# Altium project PowerMonitorBoard.PrjPcb
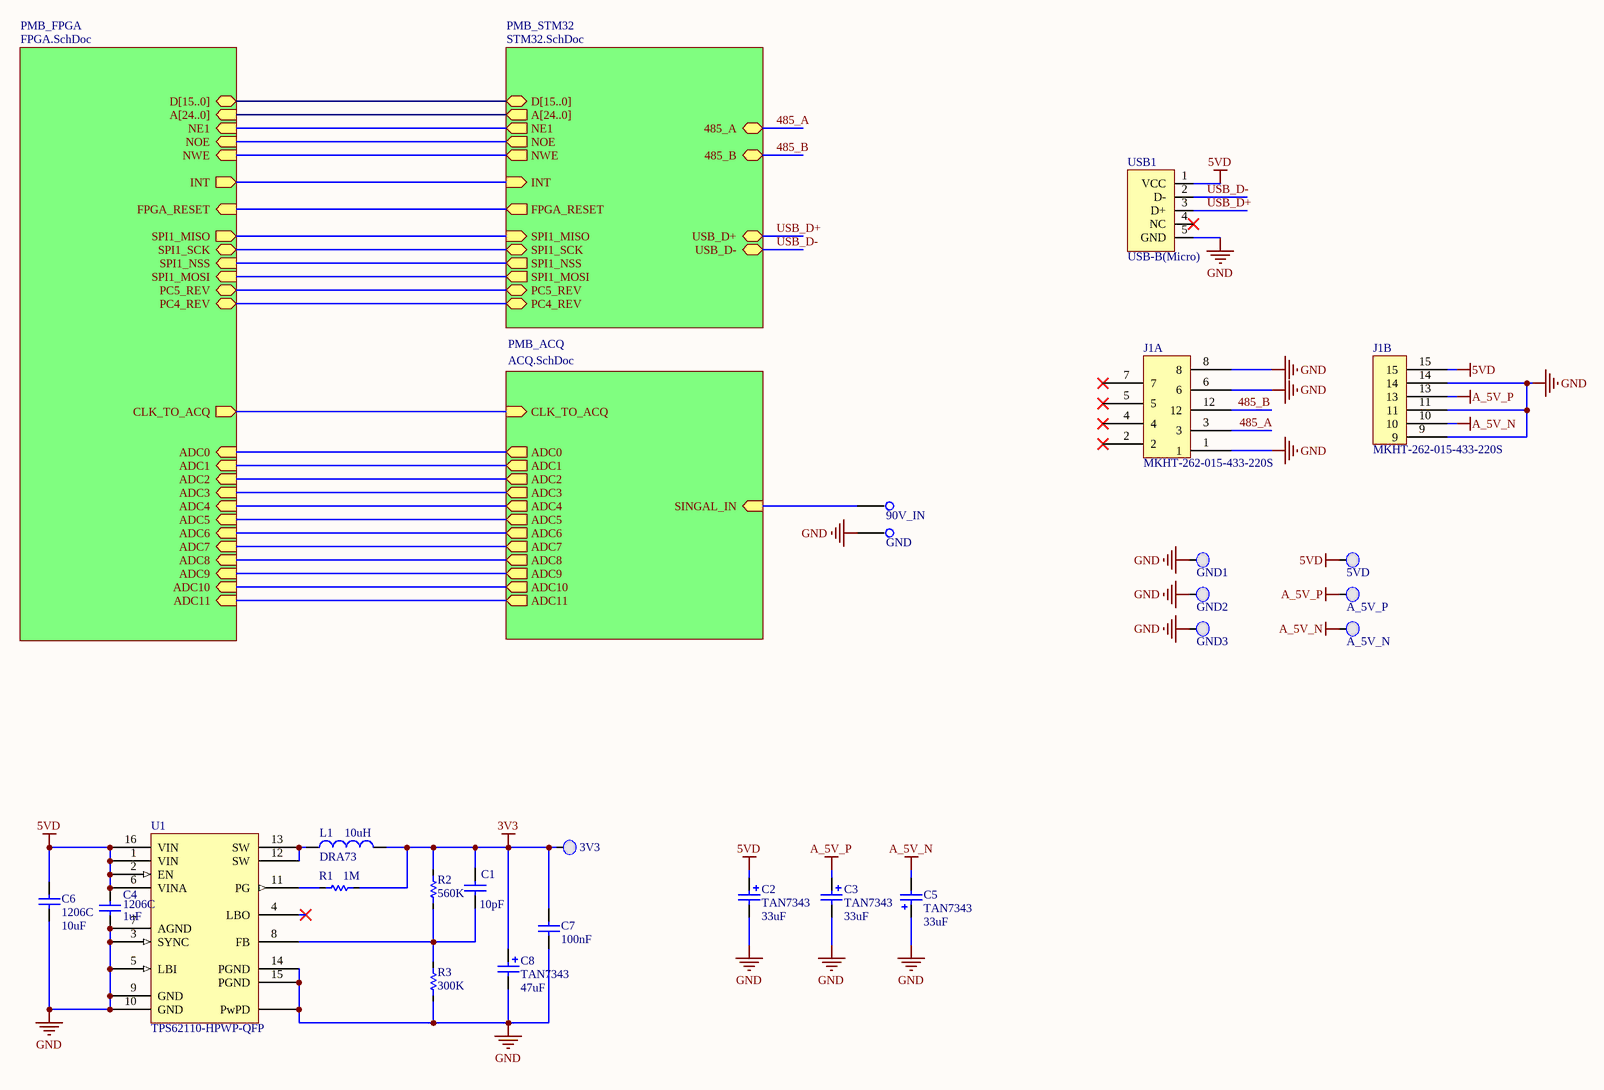
[diagram p0: TOP.SchDoc]
4 sheets, 182 parts. Net scope: hierarchical (ports join the sheet entries above them; power ports are global).
Board file: PMC_liuyao.PcbDoc
Sheets:
  TOP.SchDoc
    PMB_STM32 = STM32.SchDoc
    PMB_FPGA = FPGA.SchDoc
    PMB_ACQ = ACQ.SchDoc

## Sheet TOP.SchDoc
size A3; DocumentNumber: 1; SheetNumber: 1; SheetTotal: 4

### Parts
3V3  TP  [TPA]  (value not drawn)
5VD  TP  [TPA]  (value not drawn)
90V_IN  InOut  [TERMPOWER]  (value not drawn)
A_5V_N  TP  [TPA]  (value not drawn)
A_5V_P  TP  [TPA]  (value not drawn)
C1  10pF  [0805C]
C2  TAN7343  value 33uF  [7343C]
C3  TAN7343  value 33uF  [7343C]
C4  1uF  [1206C]
C5  TAN7343  value 33uF  [7343C]
C6  10uF  [1206C]
C7  100nF  [0805C]
C8  TAN7343  value 47uF  [7343C]
GND  InOut  [TERMPOWER]  (value not drawn)
GND1  TP  [TPA]  (value not drawn)
GND2  TP  [TPA]  (value not drawn)
GND3  TP  [TPA]  (value not drawn)
J1  MKHT-262-015-433-220S  [MKHT-262-015-433-220S]  (parts A,B of 2)
L1  DRA73  value 10uH  [INDP7676X35N]
R1  1M  [0805R]
R2  560K  [0805R]
R3  300K  [0805R]
U1  TPS62110-HPWP-QFP  [PWP16]
USB1  USB-B(Micro)  [MICRO-USB-SMD_5P-P0.65-H-F_C10418]

### Sub-sheets
PMB_ACQ = ACQ.SchDoc: ADC11 (out), ADC10 (out), ADC9 (out), ADC8 (out), ADC7 (out), ADC6 (out), ADC5 (out), ADC1 (out), ADC4 (out), ADC0 (out), ADC3 (out), CLK_TO_ACQ (in), ADC2 (out), SINGAL_IN (in)
PMB_FPGA = FPGA.SchDoc: D[15..0] (bidir), A[24..0] (in), FPGA_RESET (in), NE1 (in), NOE (in), NWE (in), ADC11 (in), ADC10 (in), ADC9 (in), ADC8 (in), ADC7 (in), ADC6 (in), ADC5 (in), ADC1 (in), ADC4 (in), ADC0 (in), ADC3 (in), ADC2 (in), CLK_TO_ACQ (out), INT (out), SPI1_MISO (out), SPI1_SCK (bidir), SPI1_NSS (in), SPI1_MOSI (in), PC5_REV (bidir), PC4_REV (bidir)
PMB_STM32 = STM32.SchDoc: D[15..0] (bidir), A[24..0] (out), 485_B (bidir), 485_A (bidir), NE1 (out), NOE (out), NWE (out), INT (in), FPGA_RESET (out), SPI1_MISO (in), SPI1_SCK (bidir), SPI1_NSS (out), SPI1_MOSI (out), PC5_REV (bidir), PC4_REV (bidir), USB_D+ (bidir), USB_D- (bidir)

### Nets
3V3: 3V3.1(TP) C1.2 C7.2 C8.1 L1.2 R1.2 R2.2
5VD: 5VD.1(TP) C2.1 C4.1 C6.1 J1.15 U1.1(VIN) U1.2(EN) U1.6(VINA) U1.16(VIN) USB1.1(VCC)
A_5V_N: A_5V_N.1(TP) C5.2 J1.10
A_5V_P: A_5V_P.1(TP) C3.1 J1.13
GND: C2.2 C3.2 C4.2 C5.1 C6.2 C7.1 C8.2 GND.1(NC) GND1.1(TP) GND2.1(TP) GND3.1(TP) J1.1 J1.6 J1.8 J1.9 J1.11 J1.14 R3.1 U1.3(SYNC) U1.5(LBI) U1.7(AGND) U1.9(GND) U1.10(GND) U1.14(PGND) U1.15(PGND) U1.PwPD USB1.5(GND)
485_A: J1.3 ; sheet PMB_STM32/485_A
485_B: J1.12 ; sheet PMB_STM32/485_B
NE1: sheet PMB_STM32/NE1, sheet PMB_FPGA/NE1
NOE: sheet PMB_STM32/NOE, sheet PMB_FPGA/NOE
NRST: sheet PMB_STM32/FPGA_RESET, sheet PMB_FPGA/FPGA_RESET
NWE: sheet PMB_STM32/NWE, sheet PMB_FPGA/NWE
PC4_REV: sheet PMB_STM32/PC4_REV, sheet PMB_FPGA/PC4_REV
PC5_REV: sheet PMB_STM32/PC5_REV, sheet PMB_FPGA/PC5_REV
SPI1_MISO: sheet PMB_STM32/SPI1_MISO, sheet PMB_FPGA/SPI1_MISO
SPI1_MOSI: sheet PMB_STM32/SPI1_MOSI, sheet PMB_FPGA/SPI1_MOSI
SPI1_NSS: sheet PMB_STM32/SPI1_NSS, sheet PMB_FPGA/SPI1_NSS
SPI1_SCK: sheet PMB_STM32/SPI1_SCK, sheet PMB_FPGA/SPI1_SCK
USB_D+: USB1.3(D+) ; sheet PMB_STM32/USB_D+
USB_D-: USB1.2(D-) ; sheet PMB_STM32/USB_D-
Net90V_IN_1: 90V_IN.1(NC) ; sheet PMB_ACQ/SINGAL_IN
NetADC11_1: sheet PMB_FPGA/ADC11, sheet PMB_ACQ/ADC11
NetADC_CLK_1: sheet PMB_FPGA/CLK_TO_ACQ, sheet PMB_ACQ/CLK_TO_ACQ
NetC1_1: C1.1 R2.1 R3.2 U1.8(FB)
NetIC1_73: sheet PMB_STM32/INT, sheet PMB_FPGA/INT
NetL1_1: L1.1 U1.12(SW) U1.13(SW)
NetR1_1: R1.1 U1.11(PG)
NetR16_1: sheet PMB_FPGA/ADC0, sheet PMB_ACQ/ADC0
NetR17_1: sheet PMB_FPGA/ADC1, sheet PMB_ACQ/ADC1
NetR19_1: sheet PMB_FPGA/ADC2, sheet PMB_ACQ/ADC2
NetR22_1: sheet PMB_FPGA/ADC3, sheet PMB_ACQ/ADC3
NetR23_1: sheet PMB_FPGA/ADC4, sheet PMB_ACQ/ADC4
NetR24_1: sheet PMB_FPGA/ADC5, sheet PMB_ACQ/ADC5
NetR25_1: sheet PMB_FPGA/ADC6, sheet PMB_ACQ/ADC6
NetR26_1: sheet PMB_FPGA/ADC7, sheet PMB_ACQ/ADC7
NetR27_1: sheet PMB_FPGA/ADC8, sheet PMB_ACQ/ADC8
NetR28_1: sheet PMB_FPGA/ADC9, sheet PMB_ACQ/ADC9
NetR29_1: sheet PMB_FPGA/ADC10, sheet PMB_ACQ/ADC10

Not connected (* = marked no-connect by the designer): J1 2* 4* 5* 7*; U1 4(LBO)*; USB1 4(NC)*

### Buses and harness runs
bus sheet PMB_FPGA/A[24..0] = sheet PMB_STM32/A[24..0]
bus sheet PMB_FPGA/D[15..0] = sheet PMB_STM32/D[15..0]

### Library data of the parts
C1 C4 C6 C7 = Cap: Capacitor; Published: 8-Jun-2000; LatestRevisionDate: 17-Jul-2002; LatestRevisionNote: Re-released for DXP Platform.; Publisher: Altium Limited; PackageDescription: Radial Cap, Thru-Hole; 2 Leads; 0.3 in Pin Spacing
  C1: PackageReference: RAD-0.3; Value: 10pF
  C4: PackageReference: 1206C; Value: 1uF
  C6: PackageReference: 1206C; Value: 10uF
  C7: PackageReference: RAD-0.3; Value: 100nF
C2 C3 C5 C8 = Cap Pol: Polarized Capacitor (Radial)
L1 = Inductor
R1-R3 = Res1: Resistor; Published: 8-Jun-2000; LatestRevisionDate: 17-Jul-2002; LatestRevisionNote: Re-released for DXP Platform.; PackageReference: AXIAL-0.3; Publisher: Altium Limited; PackageDescription: Axial Device, Thru-Hole; 2 Leads; 0.3 in Pin Spacing
  R1: Value: 1M
  R2: Value: 560K
  R3: Value: 300K
U1 = TPS62110-HPWP: Part Number: Y20033002; 安装形式: SMT; 产品外形尺寸<高>: 1.2mm; 产品外形尺寸<长>: 6.6mm; 产品外形尺寸<宽>: 5.1mm; 引脚数目: 16; 湿敏等级（回流焊峰值）: MSL2(260C); 描述: TI;TPS62110-HPWP;175℃;HTSSOP 16PINS;MSL2(260C); id: wt.part.WTPartMaster:8901760; folder: /Default/电源及电源管理/TPS62110HPWP; 主要参数: 17-V, 1.5-A, SYNCHRONOUS STEP-DOWN CONVERTER; state: APPROVED; parent: 13; Library Path 2: 0; Library Ref: TPS62110-HPWP; Footprint Path: 0; HelpURL: \\10.185.226.160\altium_center_db\DATASHEET\TI TPS62110-HT.pdf; Footprint Ref: 0; Library Path: TPS62110-HT.SchLib; 制造商型号: TPS62110-HPWP; pname: TPS62110-HPWP; Library Ref 2: 0; Footprint Path 2: 0; Footprint Ref 2: 0; Footprint Path 3: 0; Footprint Ref 3: 0
USB1 = USB-micro

## Sheet STM32.SchDoc
size A3; DocumentNumber: 3; SheetNumber: 3; SheetTotal: 4
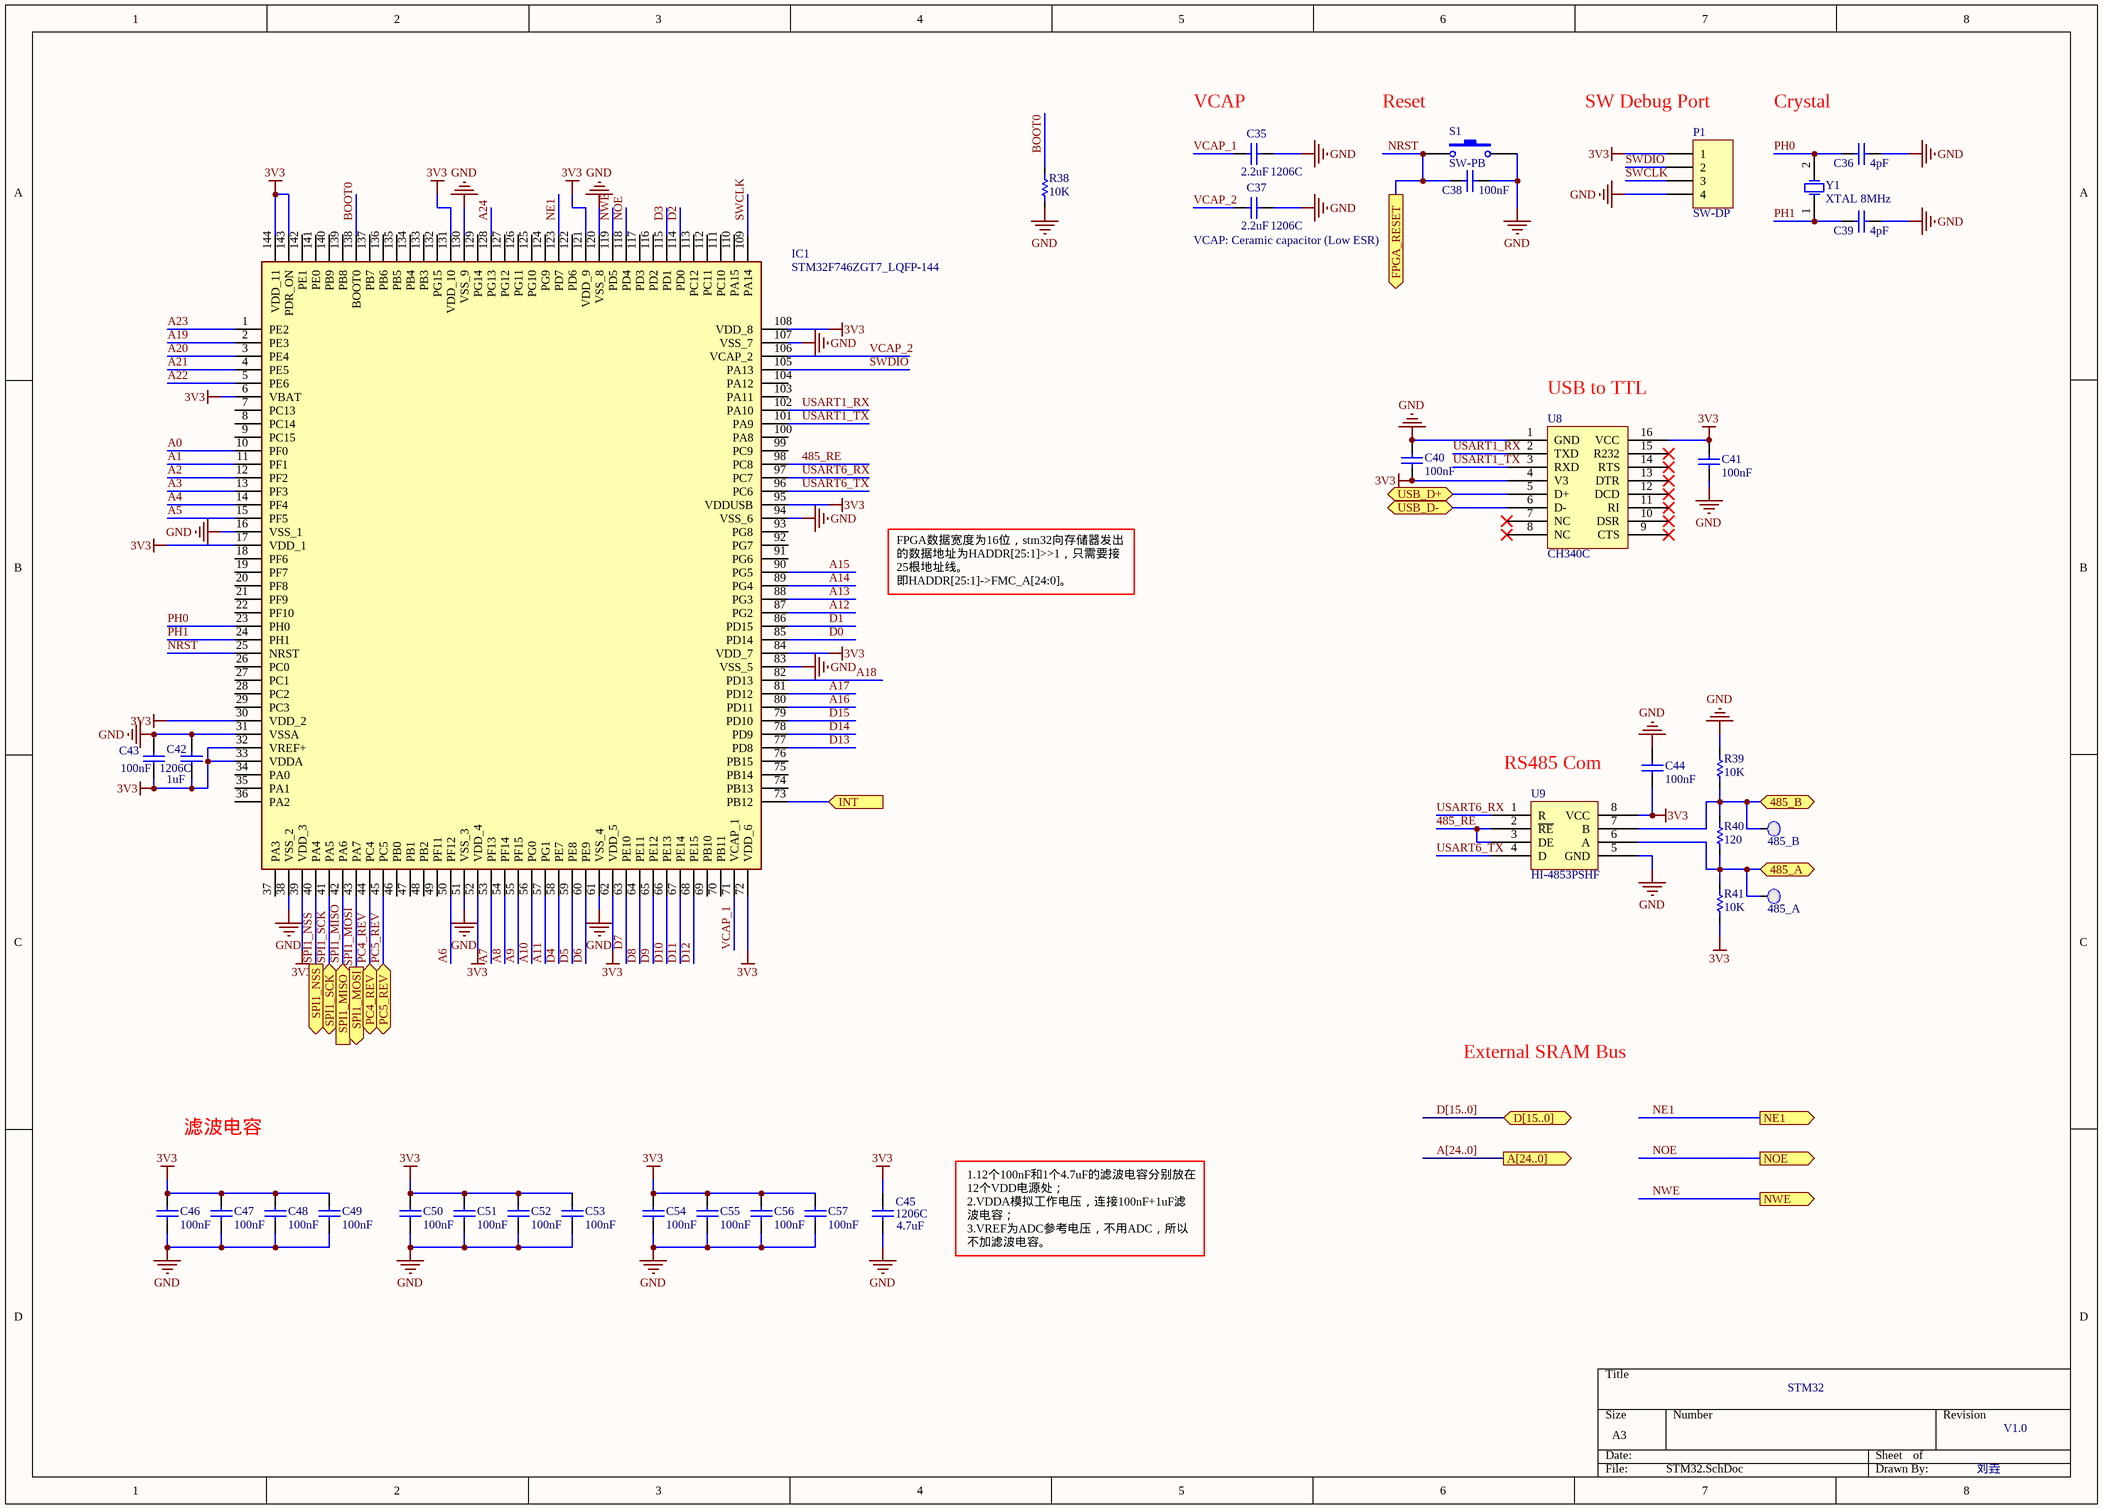
[diagram p1: STM32.SchDoc]

### Parts
485_A  TP  [TPA]  (value not drawn)
485_B  TP  [TPA]  (value not drawn)
C35  2.2uF  [1206C]
C36  4pF  [0805C]
C37  2.2uF  [1206C]
C38  100nF  [0805C]
C39  4pF  [0805C]
C40  100nF  [0805C]
C41  100nF  [0805C]
C42  1uF  [1206C]
C43  100nF  [0805C]
C44  100nF  [0805C]
C45  4.7uF  [1206C]
C46  100nF  [0805C]
C47  100nF  [0805C]
C48  100nF  [0805C]
C49  100nF  [0805C]
C50  100nF  [0805C]
C51  100nF  [0805C]
C52  100nF  [0805C]
C53  100nF  [0805C]
C54  100nF  [0805C]
C55  100nF  [0805C]
C56  100nF  [0805C]
C57  100nF  [0805C]
IC1  STM32F746ZGT7_LQFP-144  [QFP50P2200X2200X160-144N]
P1  SW-DP  [MHDR1X4]
R38  10K  [0805R]
R39  10K  [0805R]
R40  120  [0805R]
R41  10K  [0805R]
S1  SW-PB  [SW-SMD_L6.0-W3.5-LS8.0]
U8  CH340C  [CH340C]
U9  HI-4853PSHF  [SOIC-8N]
Y1  XTAL 8MHz  [NX3225GD8MHZSTDCRA3]

### Ports
485_A (bidir), 485_B (bidir), A[24..0] (out), D[15..0] (bidir), FPGA_RESET (out), INT (in), NE1 (out), NOE (out), NWE (out), PC4_REV (bidir), PC5_REV (bidir), SPI1_MISO (in), SPI1_MOSI (out), SPI1_NSS (out), SPI1_SCK (bidir), USB_D+ (bidir), USB_D- (bidir)

### Nets
3V3: C40.1 C41.2 C42.1 C43.1 C44.1 C45.2 C46.2 C47.2 C48.2 C49.2 C50.2 C51.2 C52.2 C53.2 C54.2 C55.2 C56.2 C57.2 IC1.6(VBAT) IC1.17(VDD_1) IC1.30(VDD_2) IC1.32(VREF+) IC1.33(VDDA) IC1.39(VDD_3) IC1.52(VDD_4) IC1.62(VDD_5) IC1.72(VDD_6) IC1.84(VDD_7) IC1.95(VDDUSB) IC1.108(VDD_8) IC1.121(VDD_9) IC1.131(VDD_10) IC1.143(PDR_ON) IC1.144(VDD_11) P1.1 R41.1 U8.4(V3) U8.16(VCC) U9.8(VCC)
GND: C35.1 C36.2 C37.1 C38.2 C39.2 C40.2 C41.1 C42.2 C43.2 C44.2 C45.1 C46.1 C47.1 C48.1 C49.1 C50.1 C51.1 C52.1 C53.1 C54.1 C55.1 C56.1 C57.1 IC1.16(VSS_1) IC1.31(VSSA) IC1.38(VSS_2) IC1.51(VSS_3) IC1.61(VSS_4) IC1.83(VSS_5) IC1.94(VSS_6) IC1.107(VSS_7) IC1.120(VSS_8) IC1.130(VSS_9) P1.4 R38.2 R39.2 S1.2 U8.1(GND) U9.5(GND)
485_A: 485_A.1(TP) R40.1 R41.2 U9.6(A) ; port 485_A
485_B: 485_B.1(TP) R39.1 R40.2 U9.7(B) ; port 485_B
485_RE: IC1.98(PC8) U9.2(~{RE}) U9.3(DE)
A0: IC1.10(PF0)
A1: IC1.11(PF1)
A2: IC1.12(PF2)
A3: IC1.13(PF3)
A4: IC1.14(PF4)
A5: IC1.15(PF5)
A6: IC1.50(PF12)
A7: IC1.53(PF13)
A8: IC1.54(PF14)
A9: IC1.55(PF15)
A10: IC1.56(PG0)
A11: IC1.57(PG1)
A12: IC1.87(PG2)
A13: IC1.88(PG3)
A14: IC1.89(PG4)
A15: IC1.90(PG5)
A16: IC1.80(PD11)
A17: IC1.81(PD12)
A18: IC1.82(PD13)
A19: IC1.2(PE3)
A20: IC1.3(PE4)
A21: IC1.4(PE5)
A22: IC1.5(PE6)
A23: IC1.1(PE2)
A24: IC1.128(PG13)
BOOT0: IC1.138(BOOT0) R38.1
D0: IC1.85(PD14)
D1: IC1.86(PD15)
D2: IC1.114(PD0)
D3: IC1.115(PD1)
D4: IC1.58(PE7)
D5: IC1.59(PE8)
D6: IC1.60(PE9)
D7: IC1.63(PE10)
D8: IC1.64(PE11)
D9: IC1.65(PE12)
D10: IC1.66(PE13)
D11: IC1.67(PE14)
D12: IC1.68(PE15)
D13: IC1.77(PD8)
D14: IC1.78(PD9)
D15: IC1.79(PD10)
NE1: IC1.123(PD7) ; port NE1
NOE: IC1.118(PD4) ; port NOE
NRST: C38.1 IC1.25(NRST) S1.1 ; port FPGA_RESET
NWE: IC1.119(PD5) ; port NWE
PC4_REV: IC1.44(PC4) ; port PC4_REV
PC5_REV: IC1.45(PC5) ; port PC5_REV
PH0: C36.1 IC1.23(PH0) Y1.2(OSC2)
PH1: C39.1 IC1.24(PH1) Y1.1(OSC1)
SPI1_MISO: IC1.42(PA6) ; port SPI1_MISO
SPI1_MOSI: IC1.43(PA7) ; port SPI1_MOSI
SPI1_NSS: IC1.40(PA4) ; port SPI1_NSS
SPI1_SCK: IC1.41(PA5) ; port SPI1_SCK
SWCLK: IC1.109(PA14) P1.3
SWDIO: IC1.105(PA13) P1.2
USART1_RX: IC1.102(PA10) U8.2(TXD)
USART1_TX: IC1.101(PA9) U8.3(RXD)
USART6_RX: IC1.97(PC7) U9.1(R)
USART6_TX: IC1.96(PC6) U9.4(D)
USB_D+: U8.5(D+) ; port USB_D+
USB_D-: U8.6(D-) ; port USB_D-
VCAP_1: C35.2 IC1.71(VCAP_1)
VCAP_2: C37.2 IC1.106(VCAP_2)
NetIC1_73: IC1.73(PB12) ; port INT

Not connected (* = marked no-connect by the designer): IC1 7(PC13) 8(PC14) 9(PC15) 18(PF6) 19(PF7) 20(PF8) 21(PF9) 22(PF10) 26(PC0) 27(PC1) 28(PC2) 29(PC3) 34(PA0) 35(PA1) 36(PA2) 37(PA3) 46(PB0) 47(PB1) 48(PB2) 49(PF11) 69(PB10) 70(PB11) 74(PB13) 75(PB14) 76(PB15) 91(PG6) 92(PG7) 93(PG8) 99(PC9) 100(PA8) 103(PA11) 104(PA12) 110(PA15) 111(PC10) 112(PC11) 113(PC12) 116(PD2) 117(PD3) 122(PD6) 124(PG9) 125(PG10) 126(PG11) 127(PG12) 129(PG14) 132(PG15) 133(PB3) 134(PB4) 135(PB5) 136(PB6) 137(PB7) 139(PB8) 140(PB9) 141(PE0) 142(PE1); U8 7(NC)* 8(NC)* 9(CTS)* 10(DSR)* 11(RI)* 12(DCD)* 13(DTR)* 14(RTS)* 15(R232)*

### Buses and harness runs
bus A[24..0] = port A[24..0]
bus D[15..0] = port D[15..0]

### Notes on the sheet
- (near C35) VCAP
- (near S1) Reset
- (near P1) SW Debug Port
- Crystal
- (near C37) VCAP: Ceramic capacitor (Low ESR)
- (near U8) USB to TTL
- FPGA数据宽度为16位，stm32向存储器发出的数据地址为HADDR[25:1]>>1，只需要接25根地址线。
  即HADDR[25:1]->FMC_A[24:0]。
- RS485 Com
- External SRAM Bus
- 滤波电容
- 1.12个100nF和1个4.7uF的滤波电容分别放在12个VDD电源处；
  2.VDDA模拟工作电压，连接100nF+1uF滤波电容；
  3.VREF为ADC参考电压，不用ADC，所以不加滤波电容。
- STM32
- V1.0
- 刘垚

### Library data of the parts
C35-C57 = Cap: Capacitor; Published: 8-Jun-2000; LatestRevisionDate: 17-Jul-2002; LatestRevisionNote: Re-released for DXP Platform.; Publisher: Altium Limited; PackageDescription: Radial Cap, Thru-Hole; 2 Leads; 0.3 in Pin Spacing
  C35 C37: PackageReference: 1206C; Value: 2.2uF
  C36 C39: PackageReference: RAD-0.3; Value: 4pF
  C38 C40 C41 C43 C44 C46-C57: PackageReference: RAD-0.3; Value: 100nF
  C42: PackageReference: 1206C; Value: 1uF
  C45: PackageReference: 1206C; Value: 4.7uF
IC1 = STM32F746ZGT7: Integrated Circuit; Manufacturer_Name: STMicroelectronics; Datasheet Link: http://www.st.com/content/ccc/resource/technical/document/datasheet/96/ed/61/9b/e0/6c/45/0b/DM00166116.pdf/files/DM00166116.pdf/jcr:content/translations/en.DM00166116.pdf; Height: 1.6mm; Manufacturer_Part_Number: STM32F746ZGT7; Mouser Part Number: 511-STM32F746ZGT7; Mouser Price/Stock: https://www.mouser.co.uk/ProductDetail/STMicroelectronics/STM32F746ZGT7?qs=BA62vJVifGozpDSWhcdUmw%3D%3D
P1 = MHDR1X4: Header, 4-Pin; LatestRevisionDate: 17-Jul-2002; LatestRevisionNote: Re-released for DXP Platform.; Publisher: Altium Limited
R38-R41 = Res1: Resistor; Published: 8-Jun-2000; LatestRevisionDate: 17-Jul-2002; LatestRevisionNote: Re-released for DXP Platform.; PackageReference: AXIAL-0.3; Publisher: Altium Limited; PackageDescription: Axial Device, Thru-Hole; 2 Leads; 0.3 in Pin Spacing
  R38 R39 R41: Value: 10K
  R40: Value: 120
S1 = SW-PB: Switch; Published: 24-Mar-1999; LatestRevisionDate: 17-Jul-2002; LatestRevisionNote: Re-released for DXP Platform.; PackageReference: SPST-2; Publisher: Altium Limited; PackageDescription: Switch; 2 Leads
Y1 = XTAL: Crystal Oscillator; Published: 8-Jun-2000; LatestRevisionDate: 17-Jul-2002; LatestRevisionNote: Re-released for DXP Platform.; PackageReference: R38; Publisher: Altium Limited

## Sheet FPGA.SchDoc
size A3; DocumentNumber: 4; SheetNumber: 4; SheetTotal: 4
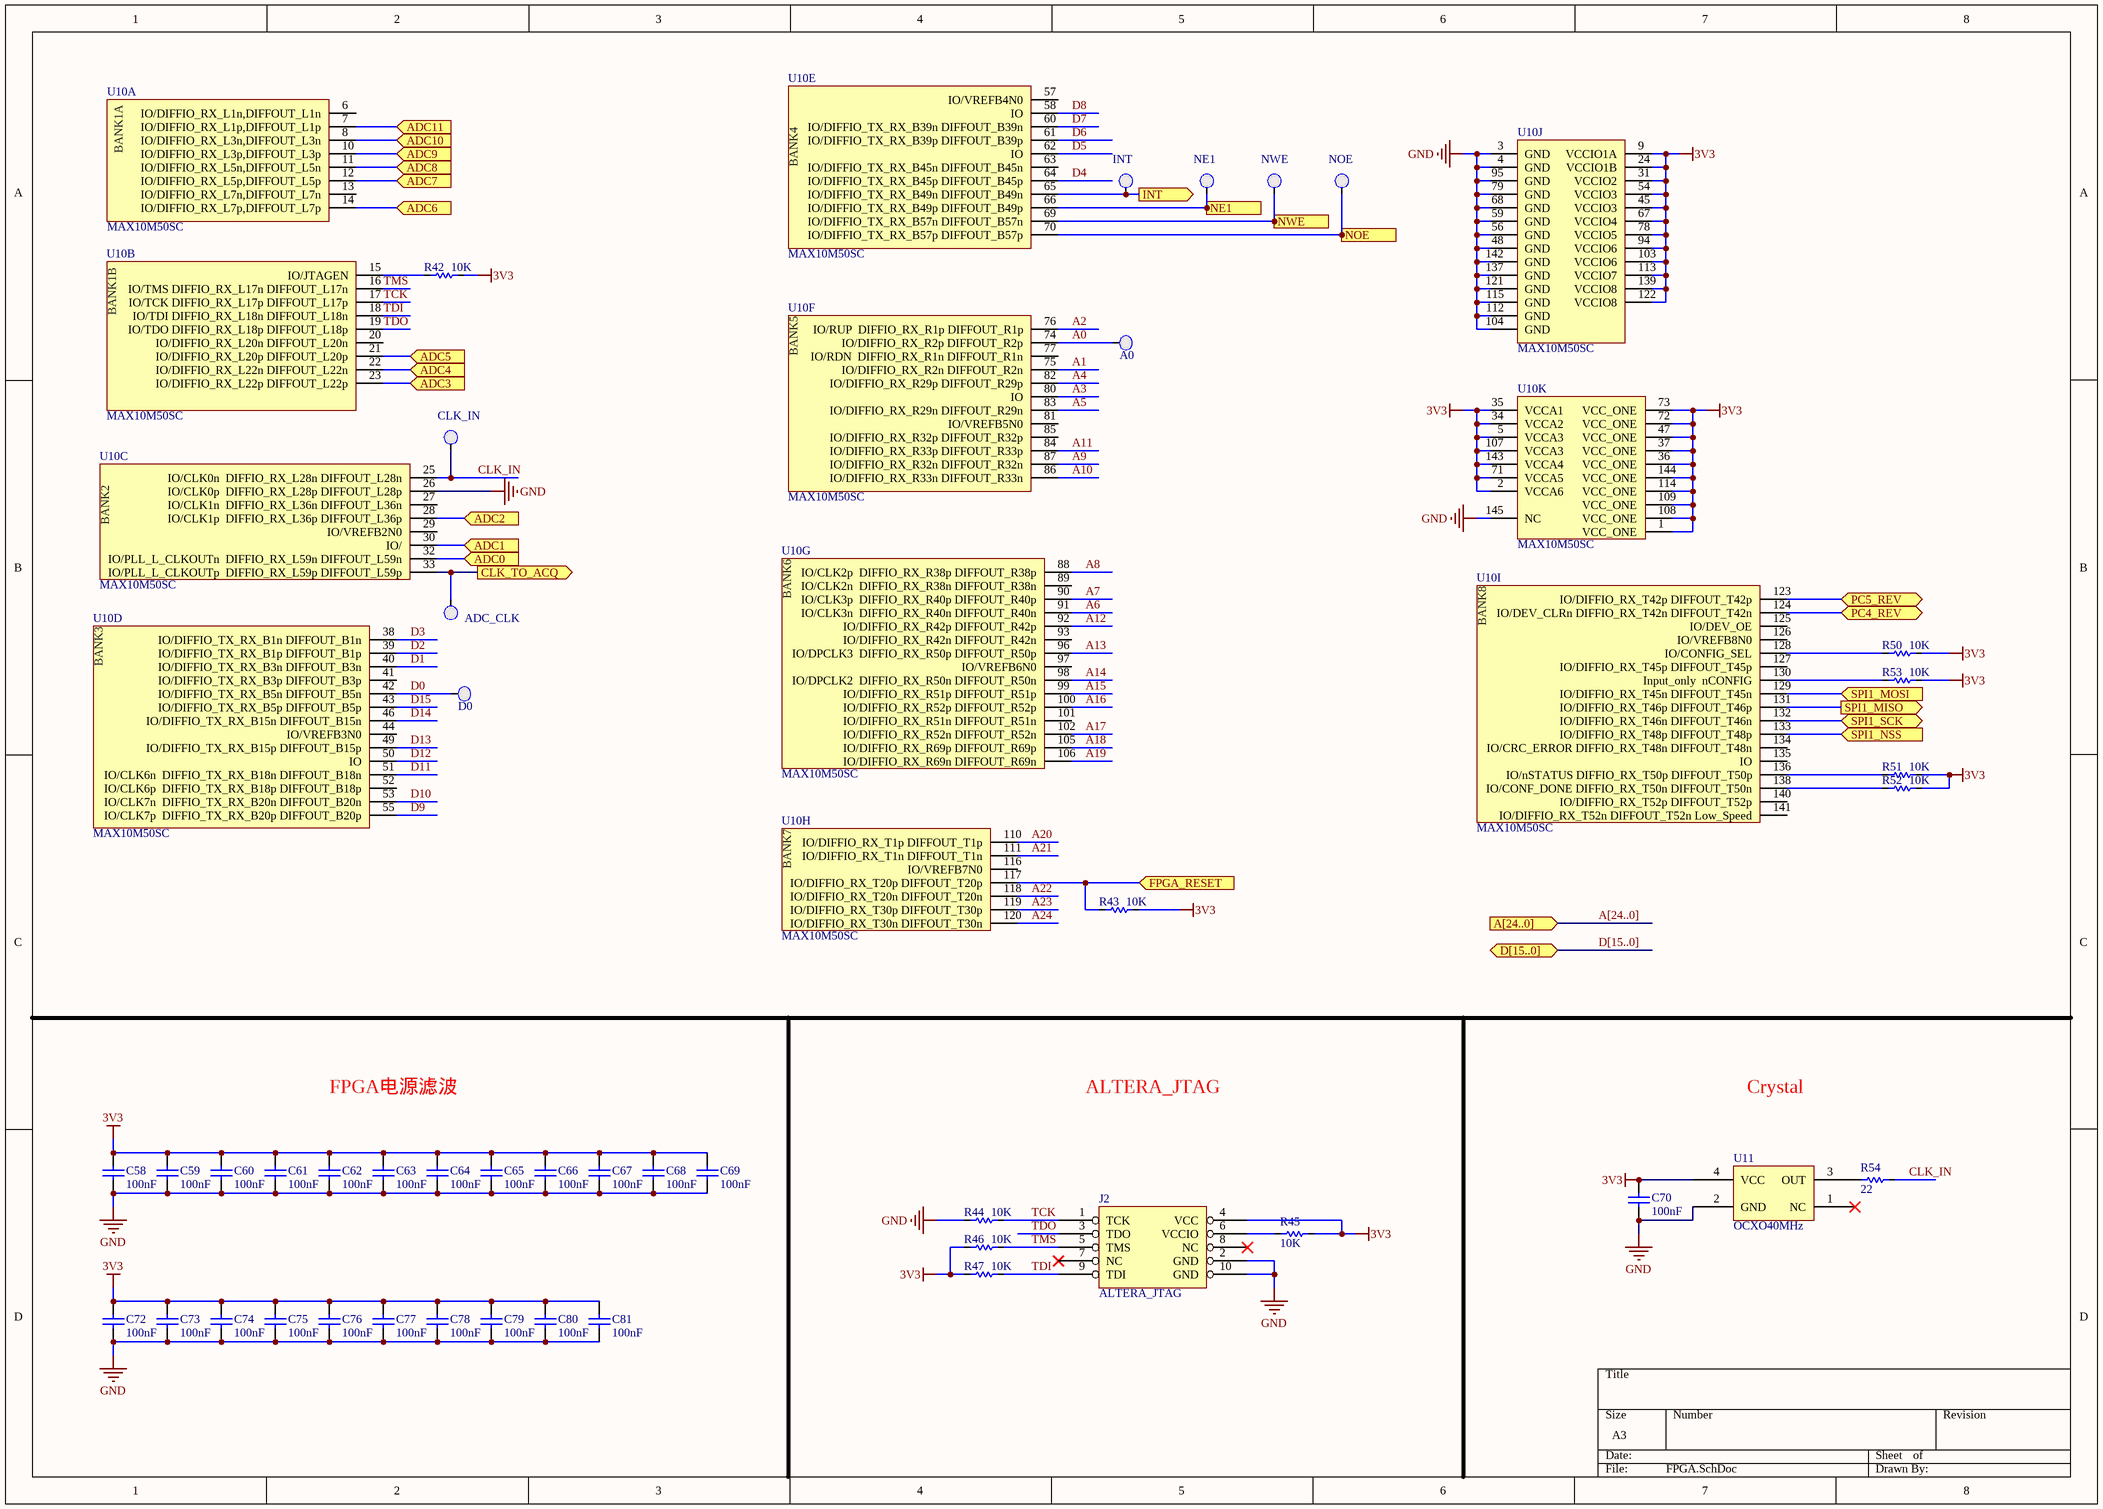
[diagram p2: FPGA.SchDoc]

### Parts
A0  TP  [TPA]  (value not drawn)
ADC_CLK  TP  [TPA]  (value not drawn)
C58  100nF  [0805C]
C59  100nF  [0805C]
C60  100nF  [0805C]
C61  100nF  [0805C]
C62  100nF  [0805C]
C63  100nF  [0805C]
C64  100nF  [0805C]
C65  100nF  [0805C]
C66  100nF  [0805C]
C67  100nF  [0805C]
C68  100nF  [0805C]
C69  100nF  [0805C]
C70  100nF  [0805C]
C72  100nF  [0805C]
C73  100nF  [0805C]
C74  100nF  [0805C]
C75  100nF  [0805C]
C76  100nF  [0805C]
C77  100nF  [0805C]
C78  100nF  [0805C]
C79  100nF  [0805C]
C80  100nF  [0805C]
C81  100nF  [0805C]
CLK_IN  TP  [TPA]  (value not drawn)
D0  TP  [TPA]  (value not drawn)
INT  TP  [TPA]  (value not drawn)
J2  ALTERA_JTAG  [JTAG_DIP]
NE1  TP  [TPA]  (value not drawn)
NOE  TP  [TPA]  (value not drawn)
NWE  TP  [TPA]  (value not drawn)
R42  10K  [0805R]
R43  10K  [0805R]
R44  10K  [0805R]
R45  10K  [0805R]
R46  10K  [0805R]
R47  10K  [0805R]
R50  10K  [0805R]
R51  10K  [0805R]
R52  10K  [0805R]
R53  10K  [0805R]
R54  22  [0805R]
U10  MAX10M50SC  [max10M50sc_Quad144]  (parts A,B,C,D,E,F,G,H,I,J,K of 11)
U11  OCXO40MHz  [OCX1]

### Ports
A[24..0] (in), ADC0 (in), ADC1 (in), ADC2 (in), ADC3 (in), ADC4 (in), ADC5 (in), ADC6 (in), ADC7 (in), ADC8 (in), ADC9 (in), ADC10 (in), ADC11 (in), CLK_TO_ACQ (out), D[15..0] (bidir), FPGA_RESET (in), INT (out), NE1 (in), NOE (in), NWE (in), PC4_REV (bidir), PC5_REV (bidir), SPI1_MISO (out), SPI1_MOSI (in), SPI1_NSS (in), SPI1_SCK (bidir)

### Nets
3V3: C58.2 C59.2 C60.2 C61.2 C62.2 C63.2 C64.2 C65.2 C66.2 C67.2 C68.2 C69.2 C70.2 C72.2 C73.2 C74.2 C75.2 C76.2 C77.2 C78.2 C79.2 C80.2 C81.2 J2.4(VCC) R42.2 R43.2 R45.2 R46.1 R47.1 R50.2 R51.2 R52.2 R53.2 U10.1(VCC_ONE) U10.2(VCCA6) U10.5(VCCA3) U10.9(VCCIO1A) U10.24(VCCIO1B) U10.31(VCCIO2) U10.34(VCCA2) U10.35(VCCA1) U10.36(VCC_ONE) U10.37(VCC_ONE) U10.45(VCCIO3) U10.47(VCC_ONE) U10.54(VCCIO3) U10.67(VCCIO4) U10.71(VCCA5) U10.72(VCC_ONE) U10.73(VCC_ONE) U10.78(VCCIO5) U10.94(VCCIO6) U10.103(VCCIO6) U10.107(VCCA3) U10.108(VCC_ONE) U10.109(VCC_ONE) U10.113(VCCIO7) U10.114(VCC_ONE) U10.122(VCCIO8) U10.139(VCCIO8) U10.143(VCCA4) U10.144(VCC_ONE) U11.4(VCC)
GND: C58.1 C59.1 C60.1 C61.1 C62.1 C63.1 C64.1 C65.1 C66.1 C67.1 C68.1 C69.1 C70.1 C72.1 C73.1 C74.1 C75.1 C76.1 C77.1 C78.1 C79.1 C80.1 C81.1 J2.2(GND) J2.10(GND) R44.1 U10.3(GND) U10.4(GND) U10.26(IO/CLK0p__DIFFIO_RX_L28p_DIFFOUT_L28p) U10.48(GND) U10.56(GND) U10.59(GND) U10.68(GND) U10.79(GND) U10.95(GND) U10.104(GND) U10.112(GND) U10.115(GND) U10.121(GND) U10.137(GND) U10.142(GND) U10.145(NC) U11.2(GND)
A0: A0.1(TP) U10.74(IO/DIFFIO_RX_R2p_DIFFOUT_R2p)
A1: U10.75(IO/DIFFIO_RX_R2n_DIFFOUT_R2n)
A2: U10.76(IO/RUP__DIFFIO_RX_R1p_DIFFOUT_R1p)
A3: U10.80(IO)
A4: U10.82(IO/DIFFIO_RX_R29p_DIFFOUT_R29p)
A5: U10.83(IO/DIFFIO_RX_R29n_DIFFOUT_R29n)
A6: U10.91(IO/CLK3n__DIFFIO_RX_R40n_DIFFOUT_R40n)
A7: U10.90(IO/CLK3p__DIFFIO_RX_R40p_DIFFOUT_R40p)
A8: U10.88(IO/CLK2p__DIFFIO_RX_R38p_DIFFOUT_R38p)
A9: U10.87(IO/DIFFIO_RX_R32n_DIFFOUT_R32n)
A10: U10.86(IO/DIFFIO_RX_R33n_DIFFOUT_R33n)
A11: U10.84(IO/DIFFIO_RX_R33p_DIFFOUT_R33p)
A12: U10.92(IO/DIFFIO_RX_R42p_DIFFOUT_R42p)
A13: U10.96(IO/DPCLK3__DIFFIO_RX_R50p_DIFFOUT_R50p)
A14: U10.98(IO/DPCLK2__DIFFIO_RX_R50n_DIFFOUT_R50n)
A15: U10.99(IO/DIFFIO_RX_R51p_DIFFOUT_R51p)
A16: U10.100(IO/DIFFIO_RX_R52p_DIFFOUT_R52p)
A17: U10.102(IO/DIFFIO_RX_R52n_DIFFOUT_R52n)
A18: U10.105(IO/DIFFIO_RX_R69p_DIFFOUT_R69p)
A19: U10.106(IO/DIFFIO_RX_R69n_DIFFOUT_R69n)
A20: U10.110(IO/DIFFIO_RX_T1p_DIFFOUT_T1p)
A21: U10.111(IO/DIFFIO_RX_T1n_DIFFOUT_T1n)
A22: U10.118(IO/DIFFIO_RX_T20n_DIFFOUT_T20n)
A23: U10.119(IO/DIFFIO_RX_T30p_DIFFOUT_T30p)
A24: U10.120(IO/DIFFIO_RX_T30n_DIFFOUT_T30n)
CLK_IN: CLK_IN.1(TP) R54.2 U10.25(IO/CLK0n__DIFFIO_RX_L28n_DIFFOUT_L28n)
D0: D0.1(TP) U10.42(IO/DIFFIO_TX_RX_B5n_DIFFOUT_B5n)
D1: U10.40(IO/DIFFIO_TX_RX_B3n_DIFFOUT_B3n)
D2: U10.39(IO/DIFFIO_TX_RX_B1p_DIFFOUT_B1p)
D3: U10.38(IO/DIFFIO_TX_RX_B1n_DIFFOUT_B1n)
D4: U10.64(IO/DIFFIO_TX_RX_B45p_DIFFOUT_B45p)
D5: U10.62(IO)
D6: U10.61(IO/DIFFIO_TX_RX_B39p_DIFFOUT_B39p)
D7: U10.60(IO/DIFFIO_TX_RX_B39n_DIFFOUT_B39n)
D8: U10.58(IO)
D9: U10.55(IO/CLK7p__DIFFIO_TX_RX_B20p_DIFFOUT_B20p)
D10: U10.53(IO/CLK7n__DIFFIO_TX_RX_B20n_DIFFOUT_B20n)
D11: U10.51(IO/CLK6n__DIFFIO_TX_RX_B18n_DIFFOUT_B18n)
D12: U10.50(IO)
D13: U10.49(IO/DIFFIO_TX_RX_B15p_DIFFOUT_B15p)
D14: U10.46(IO/DIFFIO_TX_RX_B15n_DIFFOUT_B15n)
D15: U10.43(IO/DIFFIO_TX_RX_B5p_DIFFOUT_B5p)
NE1: NE1.1(TP) U10.66(IO/DIFFIO_TX_RX_B49p_DIFFOUT_B49p) ; port NE1
NOE: NOE.1(TP) U10.70(IO/DIFFIO_TX_RX_B57p_DIFFOUT_B57p) ; port NOE
NRST: R43.1 U10.117(IO/DIFFIO_RX_T20p_DIFFOUT_T20p) ; port FPGA_RESET
NWE: NWE.1(TP) U10.69(IO/DIFFIO_TX_RX_B57n_DIFFOUT_B57n) ; port NWE
PC4_REV: U10.124(IO/DEV_CLRn_DIFFIO_RX_T42n_DIFFOUT_T42n) ; port PC4_REV
PC5_REV: U10.123(IO/DIFFIO_RX_T42p_DIFFOUT_T42p) ; port PC5_REV
SPI1_MISO: U10.131(IO/DIFFIO_RX_T46p_DIFFOUT_T46p) ; port SPI1_MISO
SPI1_MOSI: U10.129(IO/DIFFIO_RX_T45n_DIFFOUT_T45n) ; port SPI1_MOSI
SPI1_NSS: U10.133(IO/DIFFIO_RX_T48p_DIFFOUT_T48p) ; port SPI1_NSS
SPI1_SCK: U10.132(IO/DIFFIO_RX_T46n_DIFFOUT_T46n) ; port SPI1_SCK
TCK: J2.1(TCK) R44.2 U10.17(IO/TCK_DIFFIO_RX_L17p_DIFFOUT_L17p)
TDI: J2.9(TDI) R47.2 U10.18(IO/TDI_DIFFIO_RX_L18n_DIFFOUT_L18n)
TDO: J2.3(TDO) U10.19(IO/TDO_DIFFIO_RX_L18p_DIFFOUT_L18p)
TMS: J2.5(TMS) R46.2 U10.16(IO/TMS_DIFFIO_RX_L17n_DIFFOUT_L17n)
NetADC11_1: U10.7(IO/DIFFIO_RX_L1p,DIFFOUT_L1p) ; port ADC11
NetADC_CLK_1: ADC_CLK.1(TP) U10.33(IO/PLL_L_CLKOUTp__DIFFIO_RX_L59p_DIFFOUT_L59p) ; port CLK_TO_ACQ
NetIC1_73: INT.1(TP) U10.65(IO/DIFFIO_TX_RX_B49n_DIFFOUT_B49n) ; port INT
NetJ2_6: J2.6(VCCIO) R45.1
NetR16_1: U10.32(IO/PLL_L_CLKOUTn__DIFFIO_RX_L59n_DIFFOUT_L59n) ; port ADC0
NetR17_1: U10.30(IO/) ; port ADC1
NetR19_1: U10.28(IO/CLK1p__DIFFIO_RX_L36p_DIFFOUT_L36p) ; port ADC2
NetR22_1: U10.23(IO/DIFFIO_RX_L22p_DIFFOUT_L22p) ; port ADC3
NetR23_1: U10.22(IO/DIFFIO_RX_L22n_DIFFOUT_L22n) ; port ADC4
NetR24_1: U10.21(IO/DIFFIO_RX_L20p_DIFFOUT_L20p) ; port ADC5
NetR25_1: U10.14(IO/DIFFIO_RX_L7p,DIFFOUT_L7p) ; port ADC6
NetR26_1: U10.12(IO/DIFFIO_RX_L5p,DIFFOUT_L5p) ; port ADC7
NetR27_1: U10.11(IO/DIFFIO_RX_L5n,DIFFOUT_L5n) ; port ADC8
NetR28_1: U10.10(IO/DIFFIO_RX_L3p,DIFFOUT_L3p) ; port ADC9
NetR29_1: U10.8(IO/DIFFIO_RX_L3n,DIFFOUT_L3n) ; port ADC10
NetR42_1: R42.1 U10.15(IO/JTAGEN)
NetR50_1: R50.1 U10.128(IO/CONFIG_SEL)
NetR51_1: R51.1 U10.136(IO/nSTATUS_DIFFIO_RX_T50p_DIFFOUT_T50p)
NetR52_1: R52.1 U10.138(IO/CONF_DONE_DIFFIO_RX_T50n_DIFFOUT_T50n)
NetR53_1: R53.1 U10.130(Input_only__nCONFIG)
NetR54_1: R54.1 U11.3(OUT)

Not connected (* = marked no-connect by the designer): J2 7(NC)* 8(NC)*; U10 6(IO/DIFFIO_RX_L1n,DIFFOUT_L1n) 13(IO/DIFFIO_RX_L7n,DIFFOUT_L7n) 20(IO/DIFFIO_RX_L20n_DIFFOUT_L20n) 27(IO/CLK1n__DIFFIO_RX_L36n_DIFFOUT_L36n) 29(IO/VREFB2N0) 41(IO/DIFFIO_TX_RX_B3p_DIFFOUT_B3p) 44(IO/VREFB3N0) 52(IO/CLK6p__DIFFIO_TX_RX_B18p_DIFFOUT_B18p) 57(IO/VREFB4N0) 63(IO/DIFFIO_TX_RX_B45n_DIFFOUT_B45n) 77(IO/RDN__DIFFIO_RX_R1n_DIFFOUT_R1n) 81(IO/VREFB5N0) 85(IO/DIFFIO_RX_R32p_DIFFOUT_R32p) 89(IO/CLK2n__DIFFIO_RX_R38n_DIFFOUT_R38n) 93(IO/DIFFIO_RX_R42n_DIFFOUT_R42n) 97(IO/VREFB6N0) 101(IO/DIFFIO_RX_R51n_DIFFOUT_R51n) 116(IO/VREFB7N0) 125(IO/DEV_OE) 126(IO/VREFB8N0) 127(IO/DIFFIO_RX_T45p_DIFFOUT_T45p) 134(IO/CRC_ERROR_DIFFIO_RX_T48n_DIFFOUT_T48n) 135(IO) 140(IO/DIFFIO_RX_T52p_DIFFOUT_T52p) 141(IO/DIFFIO_RX_T52n_DIFFOUT_T52n_Low_Speed); U11 1(NC)*

### Buses and harness runs
bus A[24..0] = port A[24..0]
bus D[15..0] = port D[15..0]

### Notes on the sheet
- FPGA电源滤波
- ALTERA_JTAG
- Crystal
- (in symbol MAX10M50SC_144, part A) BANK1A
- (in symbol MAX10M50SC_144, part B) BANK1B
- (in symbol MAX10M50SC_144, part C) BANK2
- (in symbol MAX10M50SC_144, part D) BANK3
- (in symbol MAX10M50SC_144, part E) BANK4
- (in symbol MAX10M50SC_144, part F) BANK5
- (in symbol MAX10M50SC_144, part G) BANK6
- (in symbol MAX10M50SC_144, part H) BANK7
- (in symbol MAX10M50SC_144, part I) BANK8

### Library data of the parts
C58-C70 C72-C81 = Cap: Capacitor; Published: 8-Jun-2000; LatestRevisionDate: 17-Jul-2002; LatestRevisionNote: Re-released for DXP Platform.; PackageReference: RAD-0.3; Publisher: Altium Limited; PackageDescription: Radial Cap, Thru-Hole; 2 Leads; 0.3 in Pin Spacing; Value: 100nF
R42-R47 R50-R54 = Res1: Resistor; Published: 8-Jun-2000; LatestRevisionDate: 17-Jul-2002; LatestRevisionNote: Re-released for DXP Platform.; PackageReference: AXIAL-0.3; Publisher: Altium Limited; PackageDescription: Axial Device, Thru-Hole; 2 Leads; 0.3 in Pin Spacing
  R42-R47 R50-R53: Value: 10K
  R54: Value: 22
U10 = MAX10M50SC_144
U11 = OCXO

## Sheet ACQ.SchDoc
size A3; DocumentNumber: 2; SheetNumber: 2; SheetTotal: 4
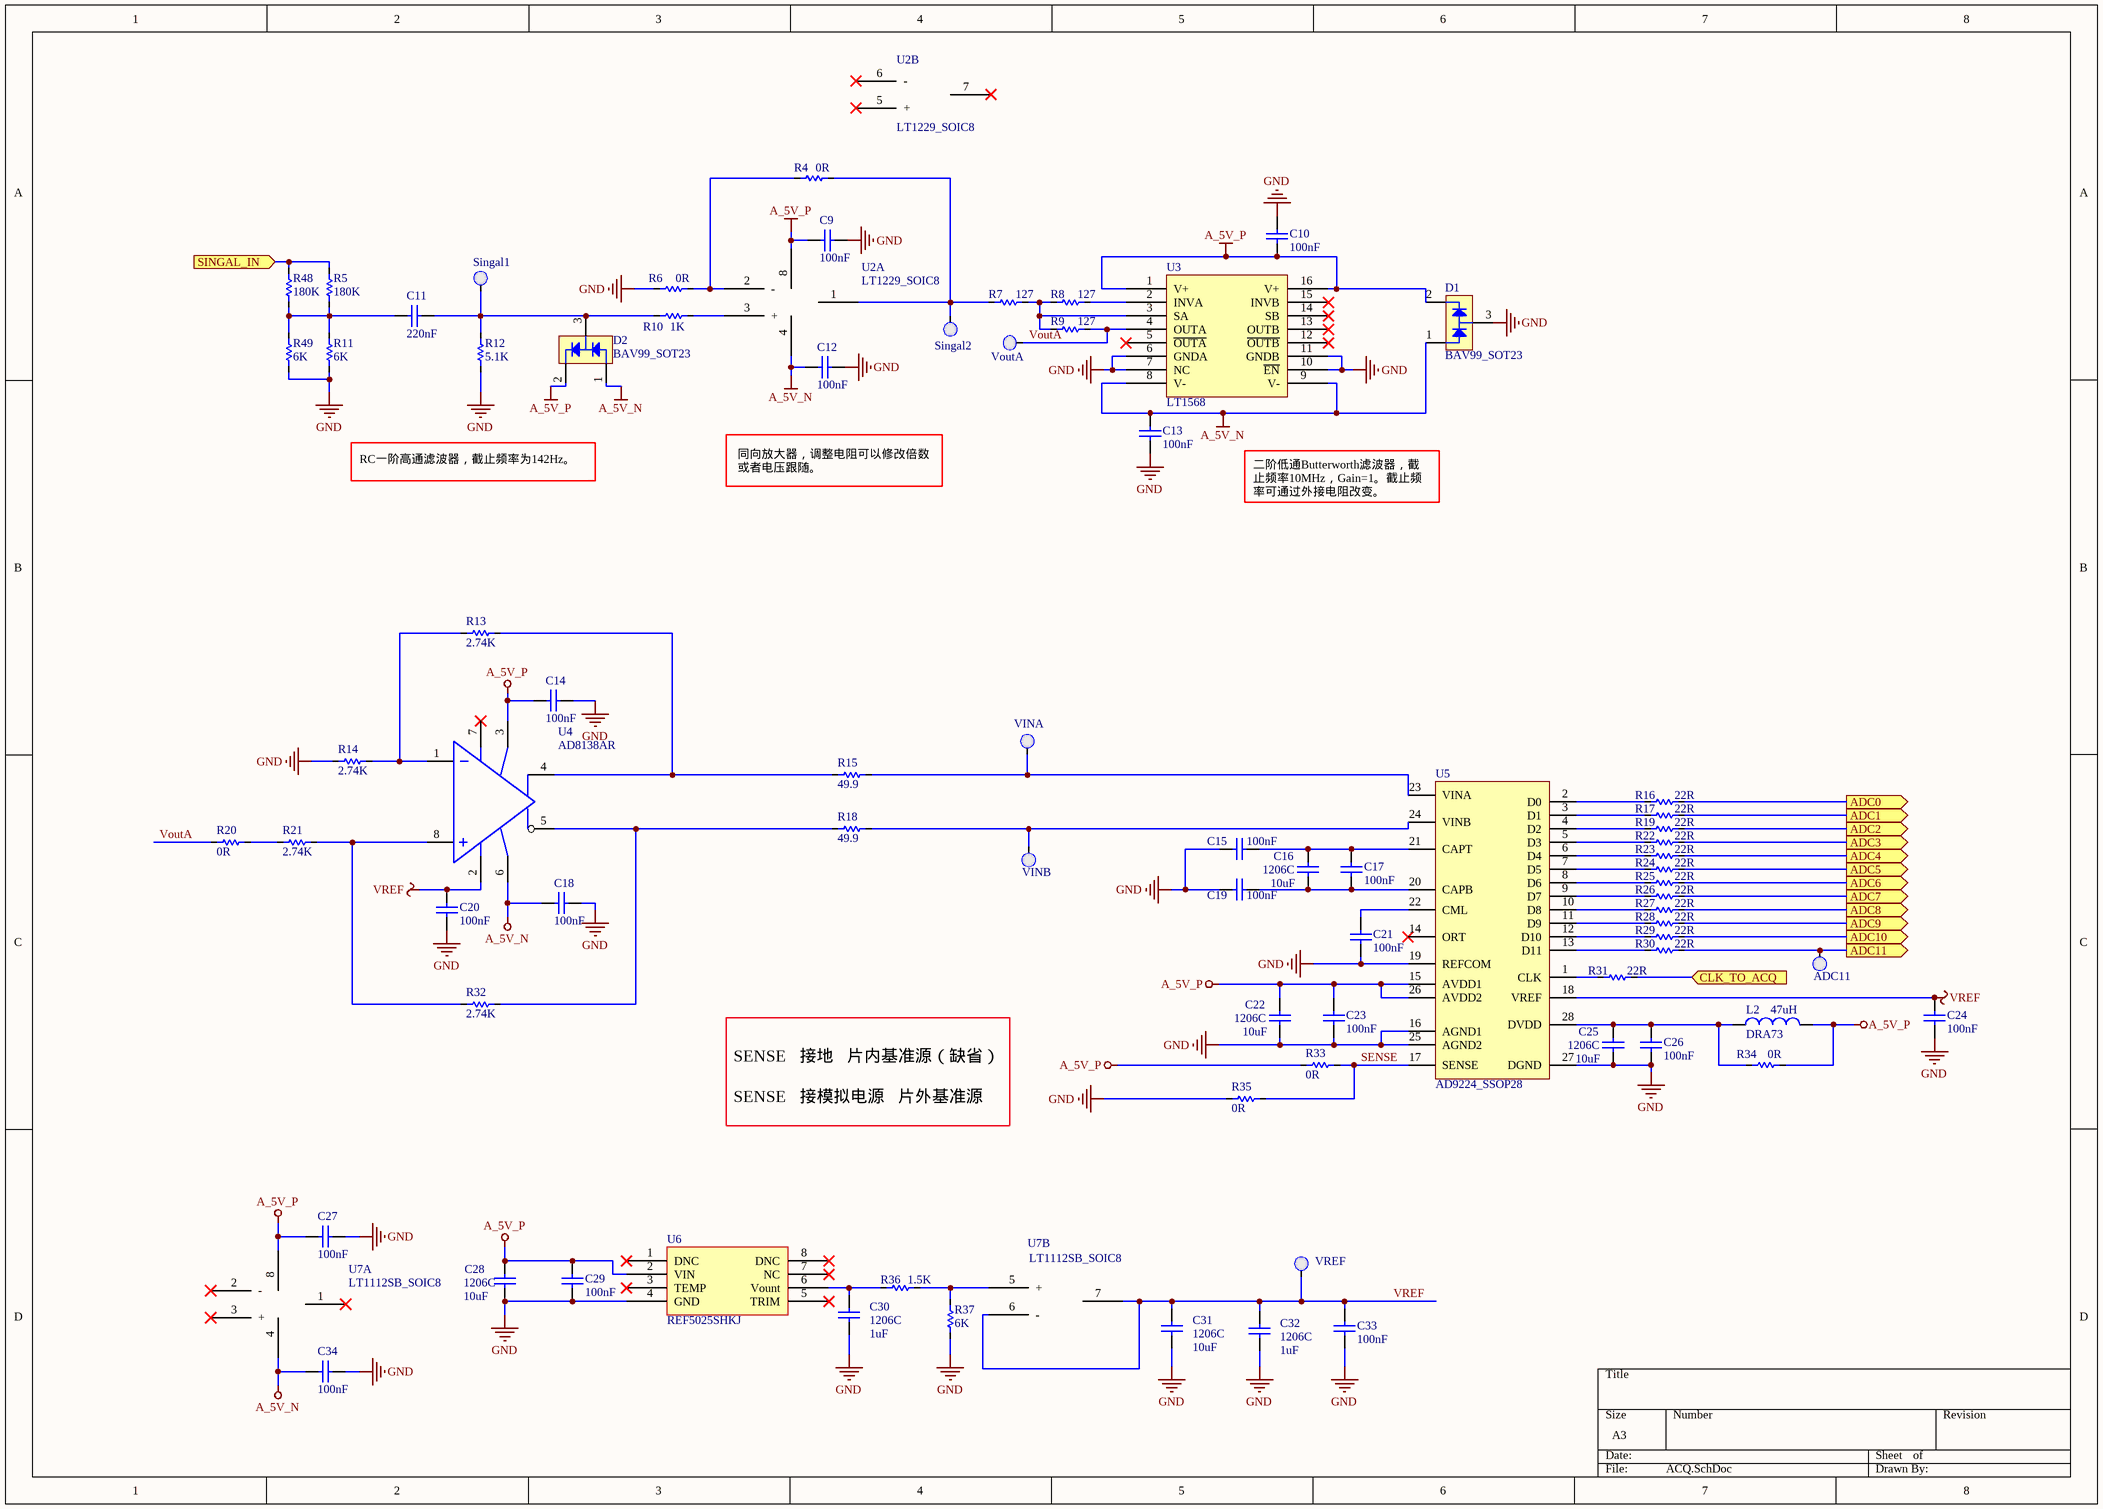
[diagram p3: ACQ.SchDoc]

### Parts
ADC11  TP  [TPA]  (value not drawn)
C9  100nF  [0805C]
C10  100nF  [0805C]
C11  220nF  [0805C]
C12  100nF  [0805C]
C13  100nF  [0805C]
C14  100nF  [0805C]
C15  100nF  [0805C]
C16  10uF  [1206C]
C17  100nF  [0805C]
C18  100nF  [0805C]
C19  100nF  [0805C]
C20  100nF  [0805C]
C21  100nF  [0805C]
C22  10uF  [1206C]
C23  100nF  [0805C]
C24  100nF  [0805C]
C25  10uF  [1206C]
C26  100nF  [0805C]
C27  100nF  [0805C]
C28  10uF  [1206C]
C29  100nF  [0805C]
C30  1uF  [1206C]
C31  10uF  [1206C]
C32  1uF  [1206C]
C33  100nF  [0805C]
C34  100nF  [0805C]
D1  BAV99_SOT23  [SOT23-3N]
D2  BAV99_SOT23  [SOT23-3N]
L2  DRA73  value 47uH  [INDP7676X35N]
R4  0R  [0805R]
R5  180K  [0805R]
R6  0R  [0805R]
R7  127  [0805R]
R8  127  [0805R]
R9  127  [0805R]
R10  1K  [0805R]
R11  6K  [0805R]
R12  5.1K  [0805R]
R13  2.74K  [0805R]
R14  2.74K  [0805R]
R15  49.9  [0805R]
R16  22R  [0805R]
R17  22R  [0805R]
R18  49.9  [0805R]
R19  22R  [0805R]
R20  0R  [0805R]
R21  2.74K  [0805R]
R22  22R  [0805R]
R23  22R  [0805R]
R24  22R  [0805R]
R25  22R  [0805R]
R26  22R  [0805R]
R27  22R  [0805R]
R28  22R  [0805R]
R29  22R  [0805R]
R30  22R  [0805R]
R31  22R  [0805R]
R32  2.74K  [0805R]
R33  0R  [0805R]
R34  0R  [0805R]
R35  0R  [0805R]
R36  1.5K  [0805R]
R37  6K  [0805R]
R48  180K  [0805R]
R49  6K  [0805R]
Singal1  TP  [TPA]  (value not drawn)
Singal2  TP  [TPA]  (value not drawn)
U2  LT1229_SOIC8  [SO-8]  (parts A,B of 2)
U3  LT1568  [SSOP16]
U4  AD8138AR  [SO-8]
U5  AD9224_SSOP28  [TSSOP28]
U6  REF5025SHKJ  [SO8-HKJ]
U7  LT1112SB_SOIC8  [SO-8]  (parts A,B of 2)
VINA  TP  [TPA]  (value not drawn)
VINB  TP  [TPA]  (value not drawn)
VoutA  TP  [TPA]  (value not drawn)
VREF  TP  [TPA]  (value not drawn)

### Ports
ADC0 (out), ADC1 (out), ADC2 (out), ADC3 (out), ADC4 (out), ADC5 (out), ADC6 (out), ADC7 (out), ADC8 (out), ADC9 (out), ADC10 (out), ADC11 (out), CLK_TO_ACQ (in), SINGAL_IN (in)

### Nets
A_5V_N: C12.2 C13.2 C18.1 C34.2 D1.1 D2.1 U2.4 U3.8(V-) U3.9(V-) U4.6(V-) U7.4
A_5V_P: C9.2 C10.1 C14.1 C22.2 C23.1 C27.1 C28.2 C29.1 D1.2 D2.2 L2.2 R33.2 R34.1 U2.8 U3.1(V+) U3.16(V+) U4.3(V+) U5.15(AVDD1) U5.26(AVDD2) U6.2(VIN) U7.8
GND: C9.1 C10.2 C12.1 C13.1 C14.2 C15.1 C18.2 C19.1 C20.2 C21.2 C22.1 C23.2 C24.2 C25.1 C26.2 C27.2 C28.1 C29.2 C30.1 C31.1 C32.1 C33.2 C34.1 D1.3 R6.2 R11.1 R12.1 R14.2 R35.2 R37.1 R49.1 U3.6(GNDA) U3.7(NC) U3.10(~{EN}) U3.11(GNDB) U5.16(AGND1) U5.19(REFCOM) U5.25(AGND2) U5.27(DGND) U6.4(GND)
VREF: C20.1 C24.1 C31.2 C32.2 C33.1 U4.2(Vcom) U5.18(VREF) U7.6(-) U7.7(OUTB) VREF.1(TP)
SENSE: R33.1 R35.1 U5.17(SENSE)
VoutA: R9.2 R20.2 U3.4(OUTA) VoutA.1(TP)
Net90V_IN_1: R5.2 R48.2 ; port SINGAL_IN
NetADC11_1: ADC11.1(TP) R30.1 ; port ADC11
NetADC_CLK_1: R31.1 ; port CLK_TO_ACQ
NetC11_1: C11.1 D2.3 R10.2 R12.2 Singal1.1(TP)
NetC11_2: C11.2 R5.1 R11.2 R48.1 R49.2
NetC15_2: C15.2 C16.2 C17.1 U5.21(CAPT)
NetC16_1: C16.1 C17.2 C19.2 U5.20(CAPB)
NetC21_1: C21.1 U5.22(CML)
NetC25_2: C25.2 C26.1 L2.1 R34.2 U5.28(DVDD)
NetC30_2: C30.2 R36.1 U6.6(Vount)
NetR4_1: R4.1 R7.1 Singal2.1(TP) U2.1(OUTA)
NetR4_2: R4.2 R6.1 U2.2(-)
NetR7_2: R7.2 R8.1 R9.1 U3.3(SA)
NetR8_2: R8.2 U3.2(INVA)
NetR10_1: R10.1 U2.3(+)
NetR13_1: R13.1 R15.2 U4.4(OUT+)
NetR13_2: R13.2 R14.1 U4.1(Din-)
NetR15_1: R15.1 U5.23(VINA) VINA.1(TP)
NetR16_1: R16.1 ; port ADC0
NetR16_2: R16.2 U5.2(D0)
NetR17_1: R17.1 ; port ADC1
NetR17_2: R17.2 U5.3(D1)
NetR18_1: R18.1 U5.24(VINB) VINB.1(TP)
NetR18_2: R18.2 R32.1 U4.5(OUT-)
NetR19_1: R19.1 ; port ADC2
NetR19_2: R19.2 U5.4(D2)
NetR20_1: R20.1 R21.2
NetR21_1: R21.1 R32.2 U4.8(Din+)
NetR22_1: R22.1 ; port ADC3
NetR22_2: R22.2 U5.5(D3)
NetR23_1: R23.1 ; port ADC4
NetR23_2: R23.2 U5.6(D4)
NetR24_1: R24.1 ; port ADC5
NetR24_2: R24.2 U5.7(D5)
NetR25_1: R25.1 ; port ADC6
NetR25_2: R25.2 U5.8(D6)
NetR26_1: R26.1 ; port ADC7
NetR26_2: R26.2 U5.9(D7)
NetR27_1: R27.1 ; port ADC8
NetR27_2: R27.2 U5.10(D8)
NetR28_1: R28.1 ; port ADC9
NetR28_2: R28.2 U5.11(D9)
NetR29_1: R29.1 ; port ADC10
NetR29_2: R29.2 U5.12(D10)
NetR30_2: R30.2 U5.13(D11)
NetR31_2: R31.2 U5.1(CLK)
NetR36_2: R36.2 R37.2 U7.5(+)

Not connected (* = marked no-connect by the designer): U2 5(+)* 6(-)* 7(OUTB)*; U3 5(~{OUTA})* 12(~{OUTB})* 13(OUTB)* 14(SB)* 15(INVB)*; U4 7(NC)*; U5 14(ORT)*; U6 1(DNC)* 3(TEMP)* 5(TRIM)* 7(NC)* 8(DNC)*; U7 1(OUTA)* 2(-)* 3(+)*

### Notes on the sheet
- RC一阶高通滤波器，截止频率为142Hz。
- 同向放大器，调整电阻可以修改倍数或者电压跟随。
- 二阶低通Butterworth滤波器，截止频率10MHz，Gain=1。截止频率可通过外接电阻改变。
- SENSE   接地   片内基准源（缺省）
- SENSE   接模拟电源   片外基准源

### Library data of the parts
C9-C34 = Cap: Capacitor; Published: 8-Jun-2000; LatestRevisionDate: 17-Jul-2002; LatestRevisionNote: Re-released for DXP Platform.; Publisher: Altium Limited; PackageDescription: Radial Cap, Thru-Hole; 2 Leads; 0.3 in Pin Spacing
  C9 C10 C12-C15 C17-C21 C23 C24 C26 C27 C29 C33 C34: PackageReference: RAD-0.3; Value: 100nF
  C11: PackageReference: RAD-0.3; Value: 220nF
  C16 C22 C25 C28 C31: PackageReference: 1206C; Value: 10uF
  C30 C32: PackageReference: 1206C; Value: 1uF
D1 D2 = BAV99LT1
L2 = Inductor
R4-R37 R48 R49 = Res1: Resistor; Published: 8-Jun-2000; LatestRevisionDate: 17-Jul-2002; LatestRevisionNote: Re-released for DXP Platform.; PackageReference: AXIAL-0.3; Publisher: Altium Limited; PackageDescription: Axial Device, Thru-Hole; 2 Leads; 0.3 in Pin Spacing
  R4 R6 R20 R33-R35: Value: 0R
  R5 R48: Value: 180K
  R7-R9: Value: 127
  R10: Value: 1K
  R11 R37 R49: Value: 6K
  R12: Value: 5.1K
  R13 R14 R21 R32: Value: 2.74K
  R15 R18: Value: 49.9
  R16 R17 R19 R22-R31: Value: 22R
  R36: Value: 1.5K
U2 U7 = AD827
U5 = AD9224

## Nets that join several sheets
3V3: TOP (7 pins), STM32 (39 pins), FPGA (63 pins)
A_5V_N: TOP (A_5V_N.1 C5.2 J1.10), ACQ (11 pins)
A_5V_P: TOP (A_5V_P.1 C3.1 J1.13), ACQ (21 pins)
GND: TOP (27 pins), STM32 (39 pins), FPGA (43 pins), ACQ (40 pins)
485_A: TOP (J1.3), STM32 (485_A.1 R40.1 R41.2 U9.6)
485_B: TOP (J1.12), STM32 (485_B.1 R39.1 R40.2 U9.7)
A0: STM32 (IC1.10), FPGA (A0.1 U10.74)
A1: STM32 (IC1.11), FPGA (U10.75)
A2: STM32 (IC1.12), FPGA (U10.76)
A3: STM32 (IC1.13), FPGA (U10.80)
A4: STM32 (IC1.14), FPGA (U10.82)
A5: STM32 (IC1.15), FPGA (U10.83)
A6: STM32 (IC1.50), FPGA (U10.91)
A7: STM32 (IC1.53), FPGA (U10.90)
A8: STM32 (IC1.54), FPGA (U10.88)
A9: STM32 (IC1.55), FPGA (U10.87)
A10: STM32 (IC1.56), FPGA (U10.86)
A11: STM32 (IC1.57), FPGA (U10.84)
A12: STM32 (IC1.87), FPGA (U10.92)
A13: STM32 (IC1.88), FPGA (U10.96)
A14: STM32 (IC1.89), FPGA (U10.98)
A15: STM32 (IC1.90), FPGA (U10.99)
A16: STM32 (IC1.80), FPGA (U10.100)
A17: STM32 (IC1.81), FPGA (U10.102)
A18: STM32 (IC1.82), FPGA (U10.105)
A19: STM32 (IC1.2), FPGA (U10.106)
A20: STM32 (IC1.3), FPGA (U10.110)
A21: STM32 (IC1.4), FPGA (U10.111)
A22: STM32 (IC1.5), FPGA (U10.118)
A23: STM32 (IC1.1), FPGA (U10.119)
A24: STM32 (IC1.128), FPGA (U10.120)
D0: STM32 (IC1.85), FPGA (D0.1 U10.42)
D1: STM32 (IC1.86), FPGA (U10.40)
D2: STM32 (IC1.114), FPGA (U10.39)
D3: STM32 (IC1.115), FPGA (U10.38)
D4: STM32 (IC1.58), FPGA (U10.64)
D5: STM32 (IC1.59), FPGA (U10.62)
D6: STM32 (IC1.60), FPGA (U10.61)
D7: STM32 (IC1.63), FPGA (U10.60)
D8: STM32 (IC1.64), FPGA (U10.58)
D9: STM32 (IC1.65), FPGA (U10.55)
D10: STM32 (IC1.66), FPGA (U10.53)
D11: STM32 (IC1.67), FPGA (U10.51)
D12: STM32 (IC1.68), FPGA (U10.50)
D13: STM32 (IC1.77), FPGA (U10.49)
D14: STM32 (IC1.78), FPGA (U10.46)
D15: STM32 (IC1.79), FPGA (U10.43)
NE1: STM32 (IC1.123), FPGA (NE1.1 U10.66)
Net90V_IN_1: TOP (90V_IN.1), ACQ (R5.2 R48.2)
NetADC11_1: FPGA (U10.7), ACQ (ADC11.1 R30.1)
NetADC_CLK_1: FPGA (ADC_CLK.1 U10.33), ACQ (R31.1)
NetIC1_73: STM32 (IC1.73), FPGA (INT.1 U10.65)
NetR16_1: FPGA (U10.32), ACQ (R16.1)
NetR17_1: FPGA (U10.30), ACQ (R17.1)
NetR19_1: FPGA (U10.28), ACQ (R19.1)
NetR22_1: FPGA (U10.23), ACQ (R22.1)
NetR23_1: FPGA (U10.22), ACQ (R23.1)
NetR24_1: FPGA (U10.21), ACQ (R24.1)
NetR25_1: FPGA (U10.14), ACQ (R25.1)
NetR26_1: FPGA (U10.12), ACQ (R26.1)
NetR27_1: FPGA (U10.11), ACQ (R27.1)
NetR28_1: FPGA (U10.10), ACQ (R28.1)
NetR29_1: FPGA (U10.8), ACQ (R29.1)
NOE: STM32 (IC1.118), FPGA (NOE.1 U10.70)
NRST: STM32 (C38.1 IC1.25 S1.1), FPGA (R43.1 U10.117)
NWE: STM32 (IC1.119), FPGA (NWE.1 U10.69)
PC4_REV: STM32 (IC1.44), FPGA (U10.124)
PC5_REV: STM32 (IC1.45), FPGA (U10.123)
SPI1_MISO: STM32 (IC1.42), FPGA (U10.131)
SPI1_MOSI: STM32 (IC1.43), FPGA (U10.129)
SPI1_NSS: STM32 (IC1.40), FPGA (U10.133)
SPI1_SCK: STM32 (IC1.41), FPGA (U10.132)
USB_D+: TOP (USB1.3), STM32 (U8.5)
USB_D-: TOP (USB1.2), STM32 (U8.6)